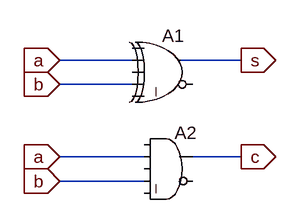
[diagram p0: schematic Half_Adder.asc]
Half_Adder.asc, the LTspice schematic file:
Version 4
SHEET 1 880 680
WIRE 128 96 32 96
WIRE 272 96 192 96
WIRE 128 128 32 128
WIRE 144 224 32 224
WIRE 272 224 208 224
WIRE 144 256 32 256
FLAG 32 96 a
IOPIN 32 96 In
FLAG 32 128 b
IOPIN 32 128 In
FLAG 32 224 a
IOPIN 32 224 In
FLAG 32 256 b
IOPIN 32 256 In
FLAG 272 224 c
IOPIN 272 224 Out
FLAG 272 96 s
IOPIN 272 96 Out
SYMBOL Digital\\xor 176 48 R0
SYMATTR InstName A1
SYMBOL Digital\\and 176 176 R0
SYMATTR InstName A2

The netlist it stands for:
* Half_Adder.asc
A1 0 a 0 b 0 0 s 0 XOR
A2 0 a 0 b 0 0 c 0 AND
.backanno
.end